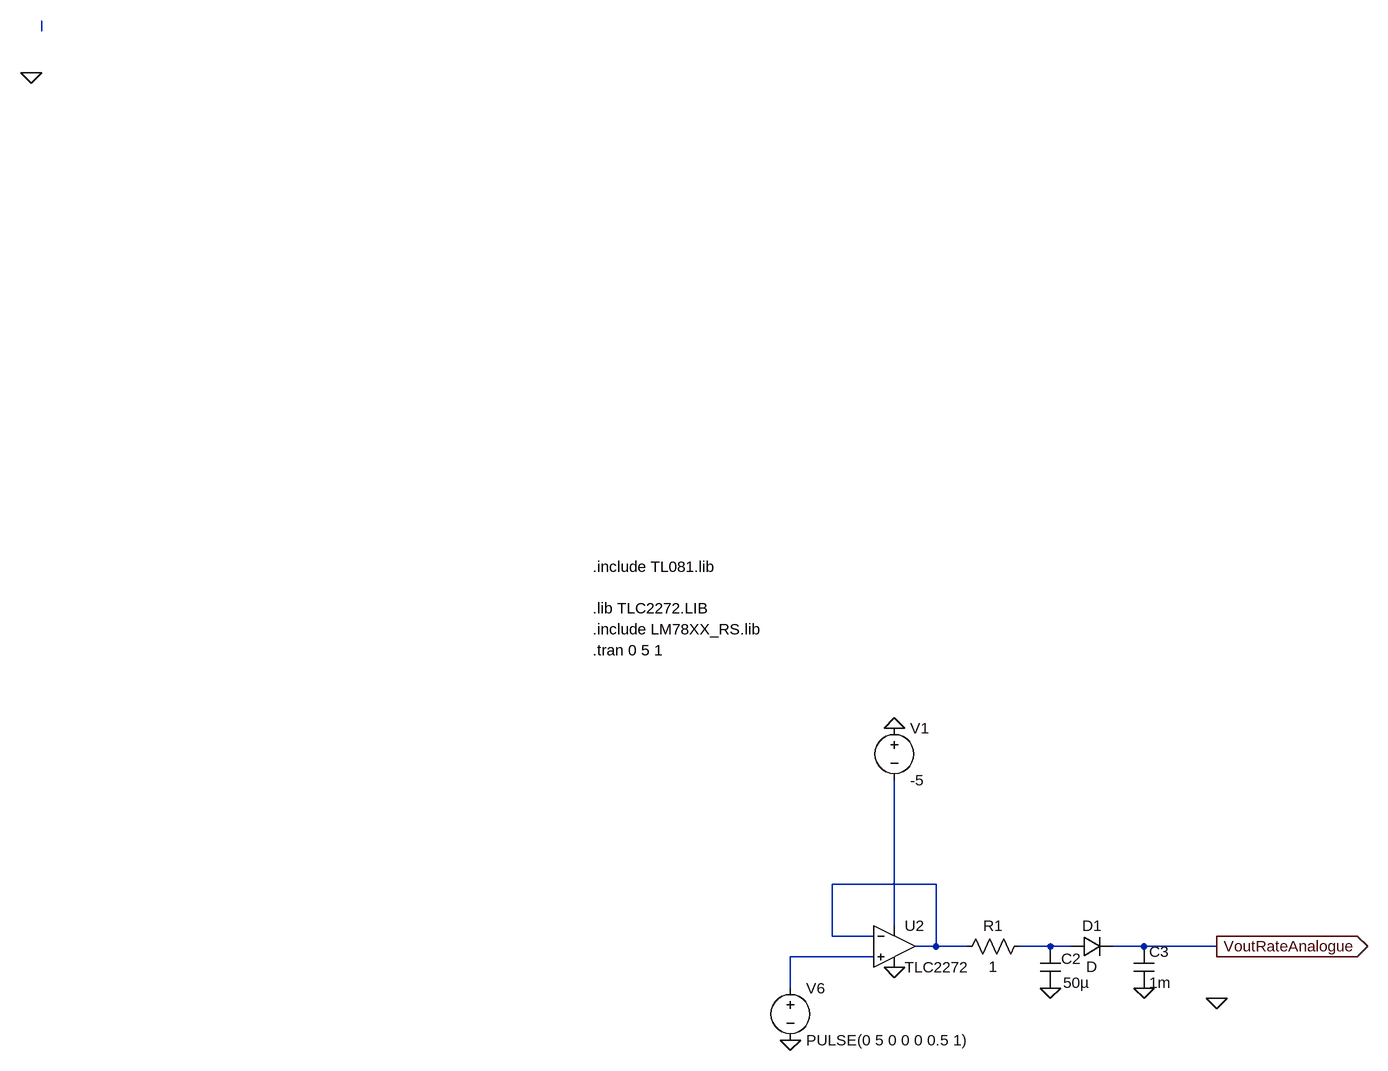
[diagram p0: schematic FVC.asc]
FVC.asc, the LTspice schematic file:
Version 4
SHEET 1 2416 680
WIRE -64 -1264 -64 -1280
WIRE 1312 48 1152 48
WIRE 1248 112 1248 -112
WIRE 1152 128 1152 48
WIRE 1216 128 1152 128
WIRE 1312 144 1312 48
WIRE 1312 144 1280 144
WIRE 1360 144 1312 144
WIRE 1488 144 1440 144
WIRE 1520 144 1488 144
WIRE 1632 144 1584 144
WIRE 1744 144 1632 144
WIRE 1216 160 1088 160
WIRE 1088 208 1088 160
FLAG -80 -1200 0
FLAG 1488 208 0
FLAG 1744 224 0
FLAG 1632 208 0
FLAG 1248 176 0
FLAG 1744 144 VoutRateAnalogue
IOPIN 1744 144 Out
FLAG 1088 288 0
FLAG 1248 -192 0
SYMBOL cap 1472 144 R0
WINDOW 0 33 19 Left 2
WINDOW 3 36 56 Left 2
SYMATTR InstName C2
SYMATTR Value 50µ
SYMBOL diode 1520 160 R270
WINDOW 0 32 32 VTop 2
WINDOW 3 0 32 VBottom 2
SYMATTR InstName D1
SYMBOL cap 1616 144 R0
SYMATTR InstName C3
SYMATTR Value 1m
SYMBOL voltage 1088 192 R0
WINDOW 123 0 0 Left 0
WINDOW 39 0 0 Left 0
SYMATTR InstName V6
SYMATTR Value PULSE(0 5 0 0 0 0.5 1)
SYMBOL Opamps\\opamp2 1248 80 R0
SYMATTR InstName U2
SYMATTR Value TLC2272
SYMBOL voltage 1248 -208 R0
WINDOW 123 0 0 Left 0
WINDOW 39 0 0 Left 0
SYMATTR InstName V1
SYMATTR Value -5
SYMBOL res 1456 128 R90
WINDOW 0 0 56 VBottom 2
WINDOW 3 32 56 VTop 2
SYMATTR InstName R1
SYMATTR Value 1
TEXT 784 -312 Left 2 !.tran 0 5 1
TEXT 784 -440 Left 2 !.include TL081.lib
TEXT 784 -344 Left 2 !.include LM78XX_RS.lib
TEXT 784 -376 Left 2 !.lib TLC2272.LIB

The netlist it stands for:
* FVC.asc
C2 N004 0 50µ
D1 N004 VoutRateAnalogue D
C3 VoutRateAnalogue 0 1m
V6 N005 0 PULSE(0 5 0 0 0 0.5 1)
XU2 N005 N002 N003 0 N002 TLC2272  ; pins In+ In- V+ V- OUT
V1 0 N003 -5
R1 N004 N002 1
.model D D
.lib standard.dio
.tran 0 5 1
.include TL081.lib
.include LM78XX_RS.lib
.lib TLC2272.LIB
.backanno
.end